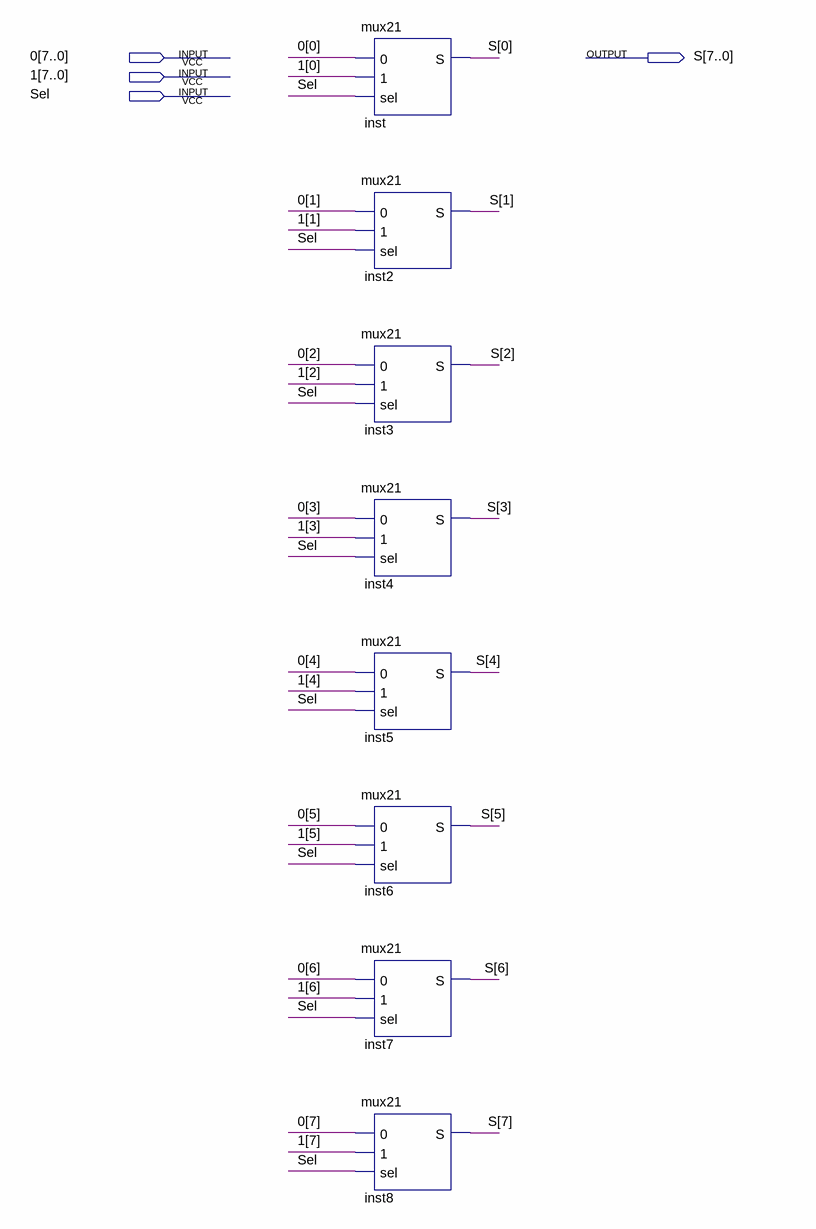
[diagram p0: schematic sheet]
// Quartus schematic mux8bits21.bdf as structural Verilog: 8 symbols, 4 pins
module mux8bits21 (
  input  [7:0] \0 ,
  input  [7:0] \1 ,
  input  Sel,
  output [7:0] S
);

  mux21 inst (.\0 (\0 [0]), .\1 (\1 [0]), .sel(Sel), .S(S[0]));
  mux21 inst2 (.\0 (\0 [1]), .\1 (\1 [1]), .sel(Sel), .S(S[1]));
  mux21 inst3 (.\0 (\0 [2]), .\1 (\1 [2]), .sel(Sel), .S(S[2]));
  mux21 inst4 (.\0 (\0 [3]), .\1 (\1 [3]), .sel(Sel), .S(S[3]));
  mux21 inst5 (.\0 (\0 [4]), .\1 (\1 [4]), .sel(Sel), .S(S[4]));
  mux21 inst6 (.\0 (\0 [5]), .\1 (\1 [5]), .sel(Sel), .S(S[5]));
  mux21 inst7 (.\0 (\0 [6]), .\1 (\1 [6]), .sel(Sel), .S(S[6]));
  mux21 inst8 (.\0 (\0 [7]), .\1 (\1 [7]), .sel(Sel), .S(S[7]));
endmodule
